# Altium schematic sheet stm32f4.SchDoc
size A4
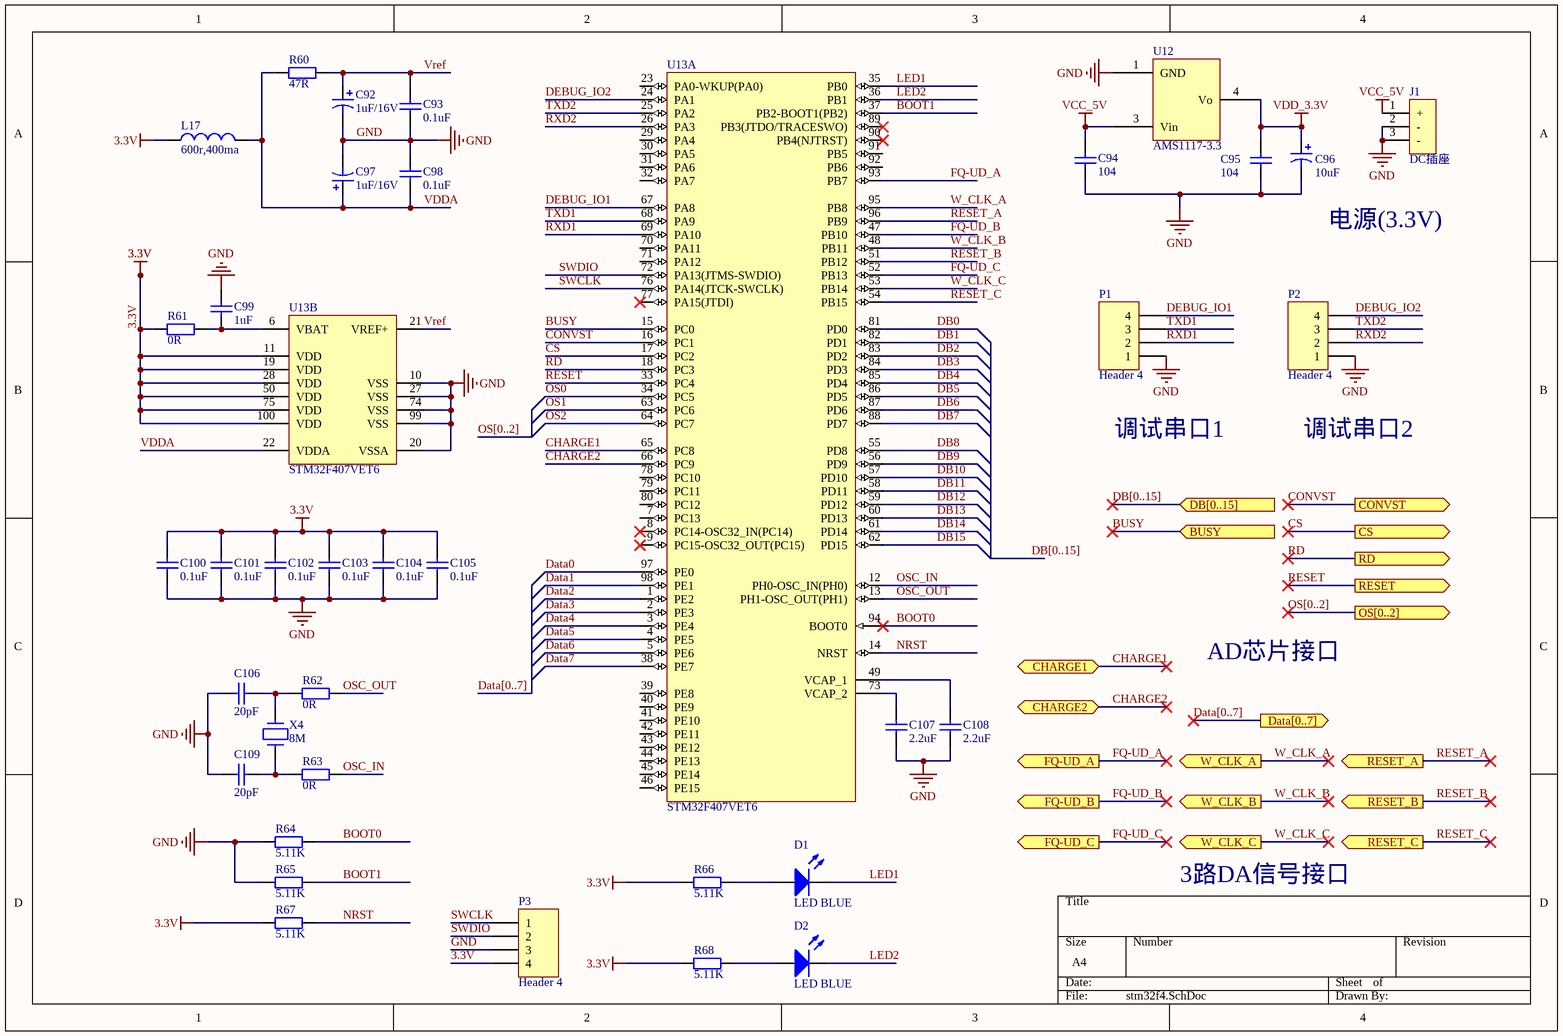
[diagram p0: stm32f4.SchDoc]

## Parts
C92  1uF/16V  [1206]
C93  0.1uF  [0805C]
C94  value 104  [0805]  (hidden comment: Cap)
C95  value 104  [0805]  (hidden comment: Cap)
C96  value 10uF  [Cap 3528B]  (hidden comment: Cap Poll)
C97  1uF/16V  [1206]
C98  0.1uF  [0805C]
C99  1uF  [0805C]
C100  0.1uF  [0805C]
C101  0.1uF  [0805C]
C102  0.1uF  [0805C]
C103  0.1uF  [0805C]
C104  0.1uF  [0805C]
C105  0.1uF  [0805C]
C106  20pF  [0805C]
C107  2.2uF  [0805C]
C108  2.2uF  [0805C]
C109  20pF  [0805C]
D1  LED BLUE  [LED_3mm]
D2  LED BLUE  [LED_3mm]
J1  DC插座  [DC插座 5.5mm*2.1mm]
L17  600r,400ma  [0805L]
P1  Header 4  [HDR1X4]
P2  Header 4  [HDR1X4]
P3  Header 4  [HDR1X4]
R60  47R  [0805R]
R61  0R  [0805R]
R62  0R  [0805R]
R63  0R  [0805R]
R64  5.11K  [0805R]
R65  5.11K  [0805R]
R66  5.11K  [0805R]
R67  5.11K  [0805R]
R68  5.11K  [0805R]
U12  AMS1117-3.3  [TO-252-2L]
U13  STM32F407VET6  [LQFP100]  (parts A,B of 2)
X4  8M  [49SMD]

## Ports
BUSY (in), CHARGE1 (bidir), CHARGE2 (bidir), CONVST (out), CS (out), Data[0..7] (out), DB[0..15] (in), FQ-UD_A (out), FQ-UD_B (out), FQ-UD_C (out), OS[0..2] (out), RD (out), RESET (out), RESET_A (out), RESET_B (out), RESET_C (out), W_CLK_A (out), W_CLK_B (out), W_CLK_C (out)

## Nets
3.3V: C100.2 C101.2 C102.2 C103.2 C104.2 C105.2 L17.1 P3.4 R61.1 R66.2 R67.2 R68.2 U13.11(VDD) U13.19(VDD) U13.28(VDD) U13.50(VDD) U13.75(VDD) U13.100(VDD)
GND: C92.2 C93.1 C94.1 C95.1 C96.2 C97.2 C98.2 C99.2 C100.1 C101.1 C102.1 C103.1 C104.1 C105.1 C106.1 C107.1 C108.1 C109.1 J1.2(-) J1.3(-) P1.1 P2.1 P3.3 R64.2 R65.2 U12.1(GND) U13.10(VSS) U13.20(VSSA) U13.27(VSS) U13.74(VSS) U13.99(VSS)
VCC_5V: C94.2 J1.1(+) U12.3(Vin)
VDD_3.3V: C95.2 C96.1 U12.4(Vo)
BOOT0: R64.1 U13.94(BOOT0)
BOOT1: R65.1 U13.37(PB2-BOOT1(PB2))
BUSY: U13.15(PC0) ; port BUSY
CHARGE1: U13.65(PC8) ; port CHARGE1
CHARGE2: U13.66(PC9) ; port CHARGE2
CONVST: U13.16(PC1) ; port CONVST
CS: U13.17(PC2) ; port CS
Data0: U13.97(PE0)
Data1: U13.98(PE1)
Data2: U13.1(PE2)
Data3: U13.2(PE3)
Data4: U13.3(PE4)
Data5: U13.4(PE5)
Data6: U13.5(PE6)
Data7: U13.38(PE7)
DB0: U13.81(PD0)
DB1: U13.82(PD1)
DB2: U13.83(PD2)
DB3: U13.84(PD3)
DB4: U13.85(PD4)
DB5: U13.86(PD5)
DB6: U13.87(PD6)
DB7: U13.88(PD7)
DB8: U13.55(PD8)
DB9: U13.56(PD9)
DB10: U13.57(PD10)
DB11: U13.58(PD11)
DB12: U13.59(PD12)
DB13: U13.60(PD13)
DB14: U13.61(PD14)
DB15: U13.62(PD15)
DEBUG_IO1: P1.4 U13.67(PA8)
DEBUG_IO2: P2.4 U13.24(PA1)
FQ-UD_A: U13.93(PB7) ; port FQ-UD_A
FQ-UD_B: U13.47(PB10) ; port FQ-UD_B
FQ-UD_C: U13.52(PB13) ; port FQ-UD_C
LED1: D1.2(K) U13.35(PB0)
LED2: D2.2(K) U13.36(PB1)
NRST: R67.1 U13.14(NRST)
OS0: U13.34(PC5)
OS1: U13.63(PC6)
OS2: U13.64(PC7)
OSC_IN: R63.2 U13.12(PH0-OSC_IN(PH0))
OSC_OUT: R62.2 U13.13(PH1-OSC_OUT(PH1))
RD: U13.18(PC3) ; port RD
RESET: U13.33(PC4) ; port RESET
RESET_A: U13.96(PB9) ; port RESET_A
RESET_B: U13.51(PB12) ; port RESET_B
RESET_C: U13.54(PB15) ; port RESET_C
RXD1: P1.2 U13.69(PA10)
RXD2: P2.2 U13.26(PA3)
SWCLK: P3.1 U13.76(PA14(JTCK-SWCLK))
SWDIO: P3.2 U13.72(PA13(JTMS-SWDIO))
TXD1: P1.3 U13.68(PA9)
TXD2: P2.3 U13.25(PA2)
VDDA: C97.1 C98.1 L17.2 R60.1 U13.22(VDDA)
Vref: C92.1 C93.2 R60.2 U13.21(VREF+)
W_CLK_A: U13.95(PB8) ; port W_CLK_A
W_CLK_B: U13.48(PB11) ; port W_CLK_B
W_CLK_C: U13.53(PB14) ; port W_CLK_C
NetC99_1: C99.1 R61.2 U13.6(VBAT)
NetC106_2: C106.2 R62.1 X4.1
NetC107_2: C107.2 U13.73(VCAP_2)
NetC108_2: C108.2 U13.49(VCAP_1)
NetC109_2: C109.2 R63.1 X4.2
NetD1_1: D1.1(A) R66.1
NetD2_1: D2.1(A) R68.1

Not connected (* = marked no-connect by the designer): U13 7(PC13) 8(PC14-OSC32_IN(PC14))* 9(PC15-OSC32_OUT(PC15))* 23(PA0-WKUP(PA0)) 29(PA4) 30(PA5) 31(PA6) 32(PA7) 39(PE8) 40(PE9) 41(PE10) 42(PE11) 43(PE12) 44(PE13) 45(PE14) 46(PE15) 70(PA11) 71(PA12) 77(PA15(JTDI))* 78(PC10) 79(PC11) 80(PC12) 89(PB3(JTDO/TRACESWO))* 90(PB4(NJTRST))* 91(PB5) 92(PB6)

## Buses and harness runs
bus Data[0..7]
bus Data[0..7] = port Data[0..7]
bus DB[0..15]
bus DB[0..15] = port DB[0..15]
bus OS[0..2]
bus OS[0..2] = port OS[0..2]

## Notes on the sheet
- 电源(3.3V)
- 调试串口1
- 调试串口2
- AD芯片接口
- 3路DA信号接口

## Library data of the parts
C92 C97 = Cap_Pol
C93 C98-C109 = Cap
C94 C95 = Cap: 原理图绘制者: 刘永钦; 原理图何处使用过: 2014年飞思卡尔底板; 原理图审核人1: 徐鹏飞; 封装0805何处使用: 2015年航行器遥控器; 原理图审核人2: 朱觉文; 封装0603何处使用过: 在2401转接板上使用; Pressure Voltage: 16V; 原理图提供者: 刘永钦; 封装0805绘制者: 刘永钦; 封装0805提供者: 刘永钦; 封装0805审核人1: 徐鹏飞; 封装0805审核人2: 朱觉文; 封装0603绘制者: 刘永钦; 封装0603提供者: 刘永钦; 封装0603审核人1: 朱觉文; 封装0603审核人2: 徐鹏飞
C96 = Cap Poll: 原理图绘制者: 刘永钦; 原理图何处使用过: 2014年飞思卡尔底板; 原理图审核人1: 徐鹏飞; 封装CAP 钽 7343 E何处使用: 2014年飞思卡尔驱动板; 封装cap贴片铝电解质470uF 16V绘制者: 李泽; 封装cap贴片铝电解质470uF 16V何处使用: 2015年飞思卡尔主板; 封装Cap 3528B绘制者: 陈汉诚; 封装Cap 3528B使用过: 2015年飞思卡尔驱动板; 封装Cap直插 10uF 50V: 10级718学长; 封装Cap直插 10uF 50V使用过: 2012年XS128学习板的主板; 封装Cap 3528B审核人2: 朱觉文; Pressure Voltage: 16V; 原理图提供者: 刘永钦; 封装CAP 钽 7343 E绘制者: 刘永钦; 封装CAP 钽 7343 E提供者: 刘永钦; 封装CAP 钽 7343 E审核人1: 徐鹏飞; 封装cap贴片铝电解质470uF 16V提供者: 刘永钦; 封装cap贴片铝电解质470uF 16V审核人1: 徐鹏飞; 封装Cap 3528B提供者: 刘永钦; 封装Cap 3528B审核人1: 徐鹏飞; 封装Cap直插 10uF 50V提供者: 刘永钦; 封装Cap直插 10uF 50V审核人1: 徐鹏飞; 封装Cap直插 10uF 50V审核人2: 朱觉文; 封装cap贴片铝电解质470uF 16V审核人2: 朱觉文; 封装CAP 钽 7343 E审核人2: 朱觉文; 原理图审核人2: 朱觉文
D1 D2 = LED
J1 = DC插座: 原理图审核人2: 朱觉文; 原理图提供者: 刘永钦; 原理图审核人1: 徐鹏飞; 原理图何处使用过: Arduino小车控制板; 原理图绘制者: 刘永钦; 封装DC插座 5.5mm*2.1mm绘制者: 刘永钦; 封装DC插座 5.5mm*2.1mm提供者: 刘永钦; 封装DC插座 5.5mm*2.1mm审核人1: 徐鹏飞; 封装DC插座 5.5mm*2.1mm何处使用过: Arduino小车控制板; 封装DC插座 5.5mm*2.1mm审核人2: 朱觉文
L17 = Inductor
P1-P3 = Header 4: Header, 4-Pin; LatestRevisionDate: 17-Jul-2002; LatestRevisionNote: Re-released for DXP Platform.; Publisher: Altium Limited
R60-R68 = Res
U12 = AMS1117
U13 = CMP-0243-00016-3: ARM Cortex-M4 32-bit MCU+FPU, 210 DMIPS, 512 kB Flash, 192 kB Internal RAM, 82 I/Os, 100-pin LQFP, -40 to 85 degC, Tray
X4 = Crystal